# Altium project PCB_Project.PrjPcb
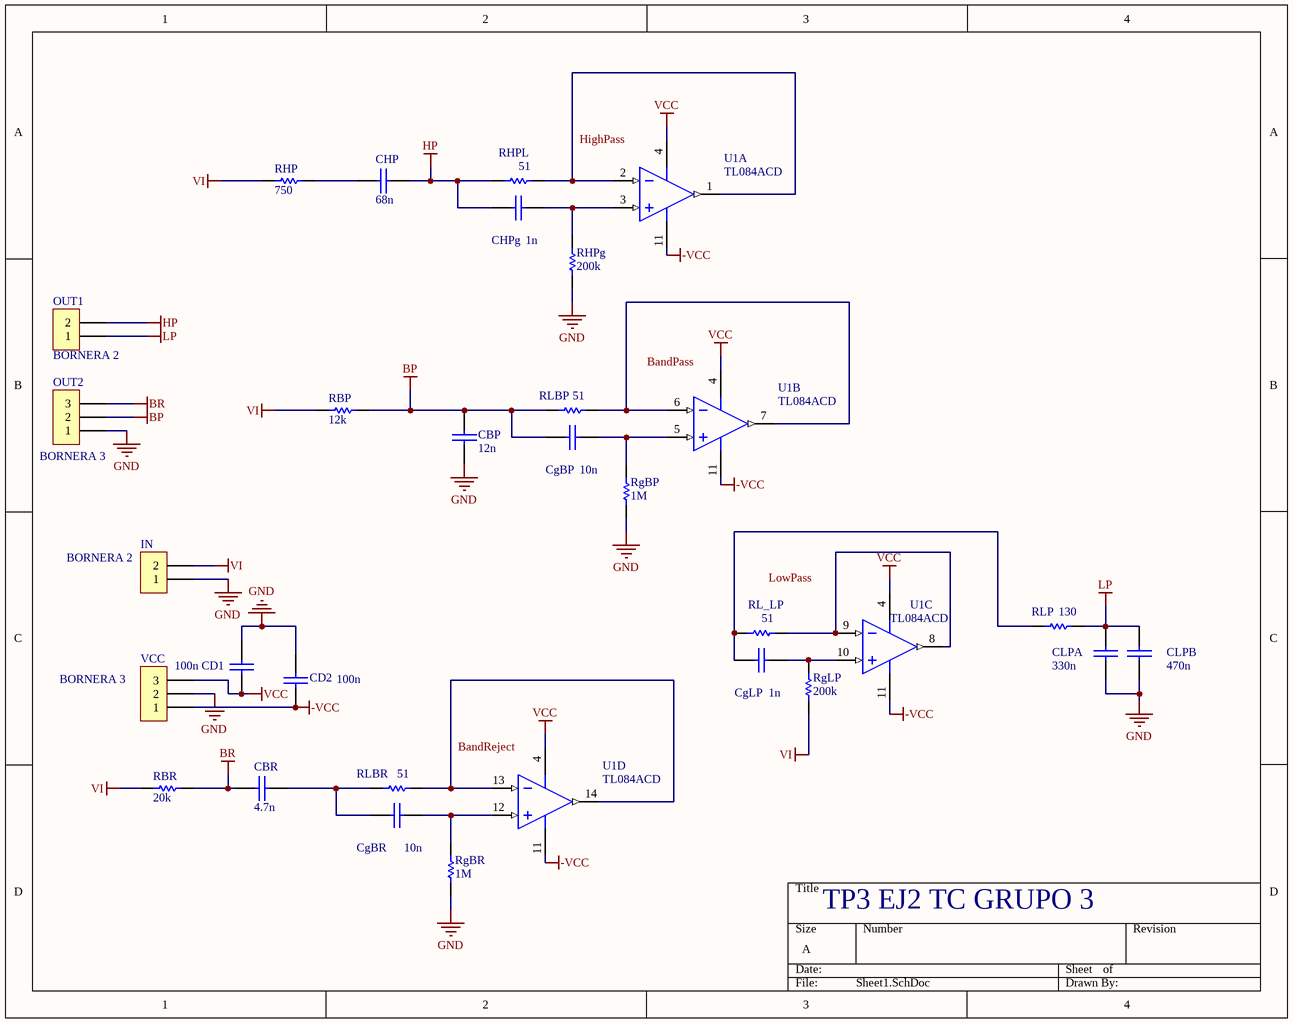
[diagram p0: Sheet1.SchDoc]
1 sheet, 28 parts. Net scope: global (net labels, ports and power ports of the same name join across sheets).
Board file: PCB1.PcbDoc

## Sheet Sheet1.SchDoc
size A

### Parts
CBP  12n  [0805]
CBR  4.7n  [0805]
CD1  100n  [CAP100]
CD2  100n  [CAP100]
CgBP  10n  [0805]
CgBR  10n  [0805]
CgLP  1n  [0805]
CHP  68n  [0805]
CHPg  1n  [0805]
CLPA  330n  [0805]
CLPB  470n  [0805]
IN  BORNERA 2  [BORNERA2]
OUT1  BORNERA 2  [BORNERA2]
OUT2  BORNERA 3  [BORNERA3]
RBP  12k  [0805]
RBR  20k  [0805]
RgBP  1M  [0805]
RgBR  1M  [0805]
RgLP  200k  [0805]
RHP  750  [0805]
RHPg  200k  [0805]
RHPL  51  [0805]
RL_LP  51  [0805]
RLBP  51  [0805]
RLBR  51  [0805]
RLP  130  [0805]
U1  TL084ACD  [DIP14]  (parts A,B,C,D of 4)
VCC  BORNERA 3  [BORNERA3]

### Nets
-VCC: CD2.1 U1.11(VCC-) VCC.1
BP: CBP.2 CgBP.1 OUT2.2 RBP.2 RLBP.1
BR: CBR.1 OUT2.3 RBR.2
GND: CBP.1 CD1.1 CD2.2 CLPA.1 CLPB.1 IN.1 OUT2.1 RgBP.1 RgBR.1 RHPg.1 VCC.2
HP: CHP.2 CHPg.1 OUT1.2 RHPL.1
LP: CLPA.2 CLPB.2 OUT1.1 RLP.2
VCC: CD1.2 U1.4(VCC+) VCC.3
VI: IN.2 RBP.1 RBR.1 RgLP.1 RHP.1
NetCBR_2: CBR.2 CgBR.1 RLBR.1
NetCgBP_2: CgBP.2 RgBP.2 U1.5(IN2+)
NetCgBR_2: CgBR.2 RgBR.2 U1.12(IN4+)
NetCgLP_1: CgLP.1 RL_LP.1 RLP.1
NetCgLP_2: CgLP.2 RgLP.2 U1.10(IN3+)
NetCHP_1: CHP.1 RHP.2
NetCHPg_2: CHPg.2 RHPg.2 U1.3(IN1+)
NetRHPL_2: RHPL.2 U1.1(OUT1) U1.2(IN1-)
NetRL_LP_2: RL_LP.2 U1.8(OUT3) U1.9(IN3-)
NetRLBP_2: RLBP.2 U1.6(IN2-) U1.7(OUT2)
NetRLBR_2: RLBR.2 U1.13(IN4-) U1.14(OUT4)

### Notes on the sheet
- TP3 EJ2 TC GRUPO 3
- Labels drawn without touching a wire or pin: BandPass, BandReject, HighPass, LowPass

### Library data of the parts
CBP CBR CD1 CD2 CgBP CgBR CgLP CHP CHPg CLPA CLPB = CAP
RBP RBR RgBP RgBR RgLP RHP RHPg RHPL RL_LP RLBP RLBR RLP = RES
U1 = TL084ACD: JFET-Input Operational Amplifier, 7 to 36 V, 0 to 70 degC, 14-pin SOIC (D14), Green (RoHS & no Sb/Br); Manufacturer: Texas Instruments; CMRR(Min)(dB): 75; GBW(Typ)(MHz): 3; IIB(Max)(pA): 200; Iq per channel(Max)(mA): 2.8; Number of Channels: 4; Offset Drift(Typ)(uV/C): 18; Rating: Catalog; Slew Rate(Typ)(V/us): 13; Sub Family: General Purpose Amplifier, High Supply Voltage Amplifier (>=30V); Total Supply Voltage(Max)(+5V is 5, +/-5V is 10): 36; Total Supply Voltage(Min)(+5V is 5, +/-5V is 10): 7; Vio (25C)(Max)(mV): 6; DatasheetVersion: SLOS081G; PackageVersion: 4040047-5/M, 06/2011; PackageReference: D14; PackageDescription: 14-Pin Plastic Small Outline, Body 8.65 x 3.90 mm, Pitch 1.27 mm; Supplier 1: Digi-Key; Supplier Part Number 1: 296-7210-5-ND; Supplier 2: Farnell; Supplier Part Number 2: 9593420; Supplier 3: Newark; Supplier Part Number 3: 08F9355; Supplier 4: Mouser; Supplier Part Number 4: 595-TL084ACD; Eco-Plan: Green (RoHS & no Sb/Br); Vn at 1kHz(Typ)(nV/rtHz): 18; Mounting Technology: Surface Mount; Code_JEDEC: MS-012; PartNumber: TL084ACD; ComponentLink1Description: Manufacturer URL; ComponentLink1URL: http://www.ti.com/; ComponentLink2Description: Datasheet; ComponentLink2URL: http://www.ti.com/lit/ds/symlink/tl084a.pdf; ComponentLink3Description: Package Specification; ComponentLink3URL: http://www.ti.com/lit/ml/mpds177g/mpds177g.pdf